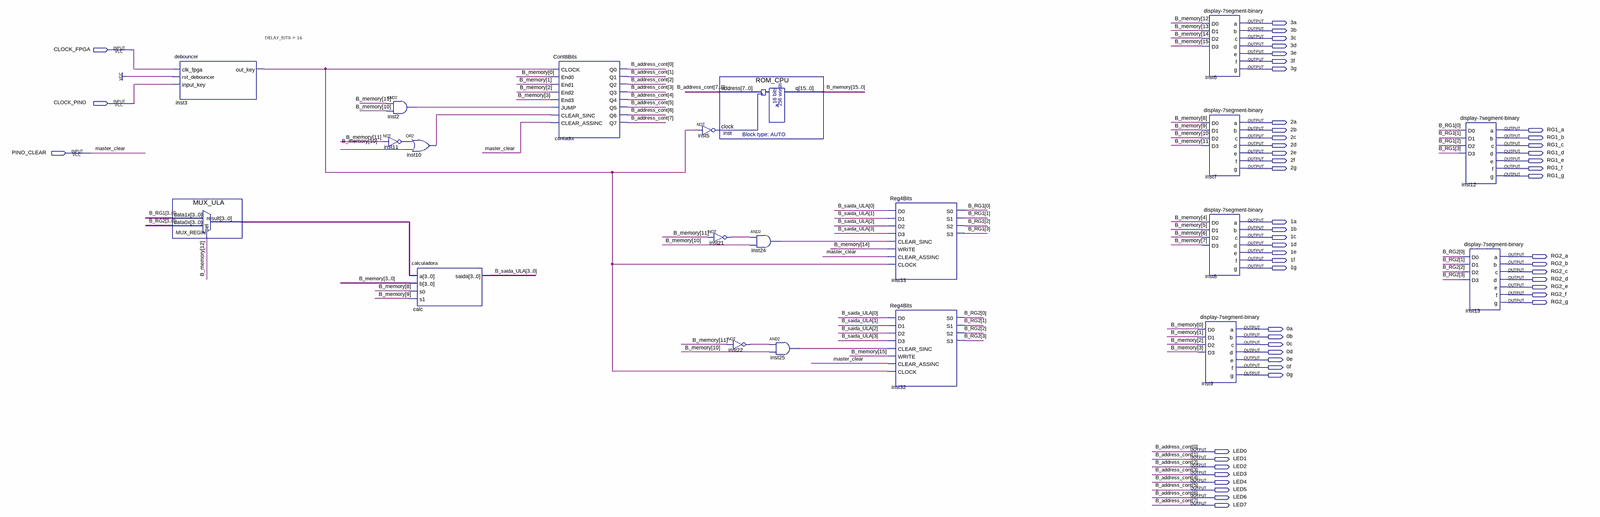
[diagram p0: schematic sheet, whole]
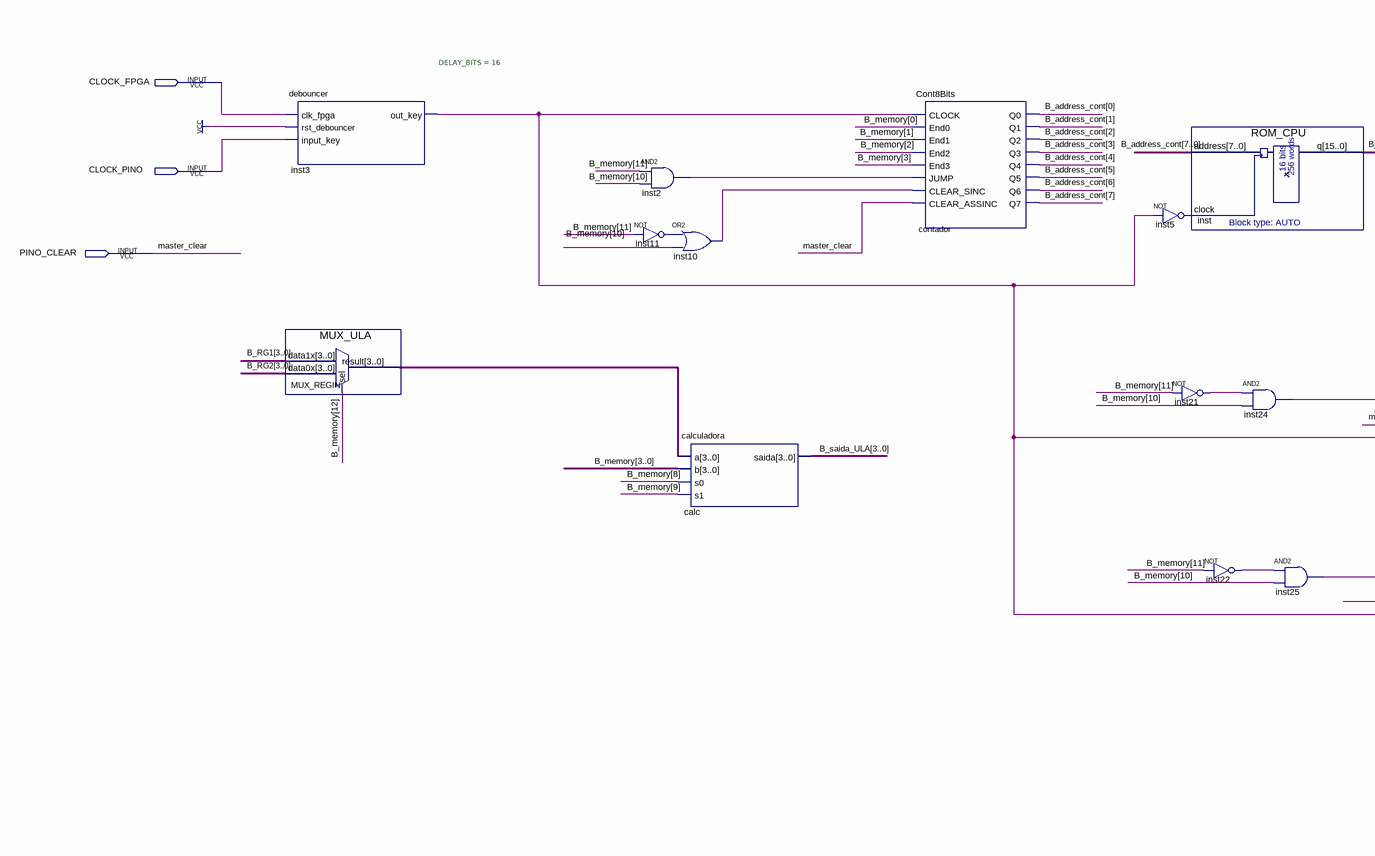
[diagram p1: schematic sheet, left part]
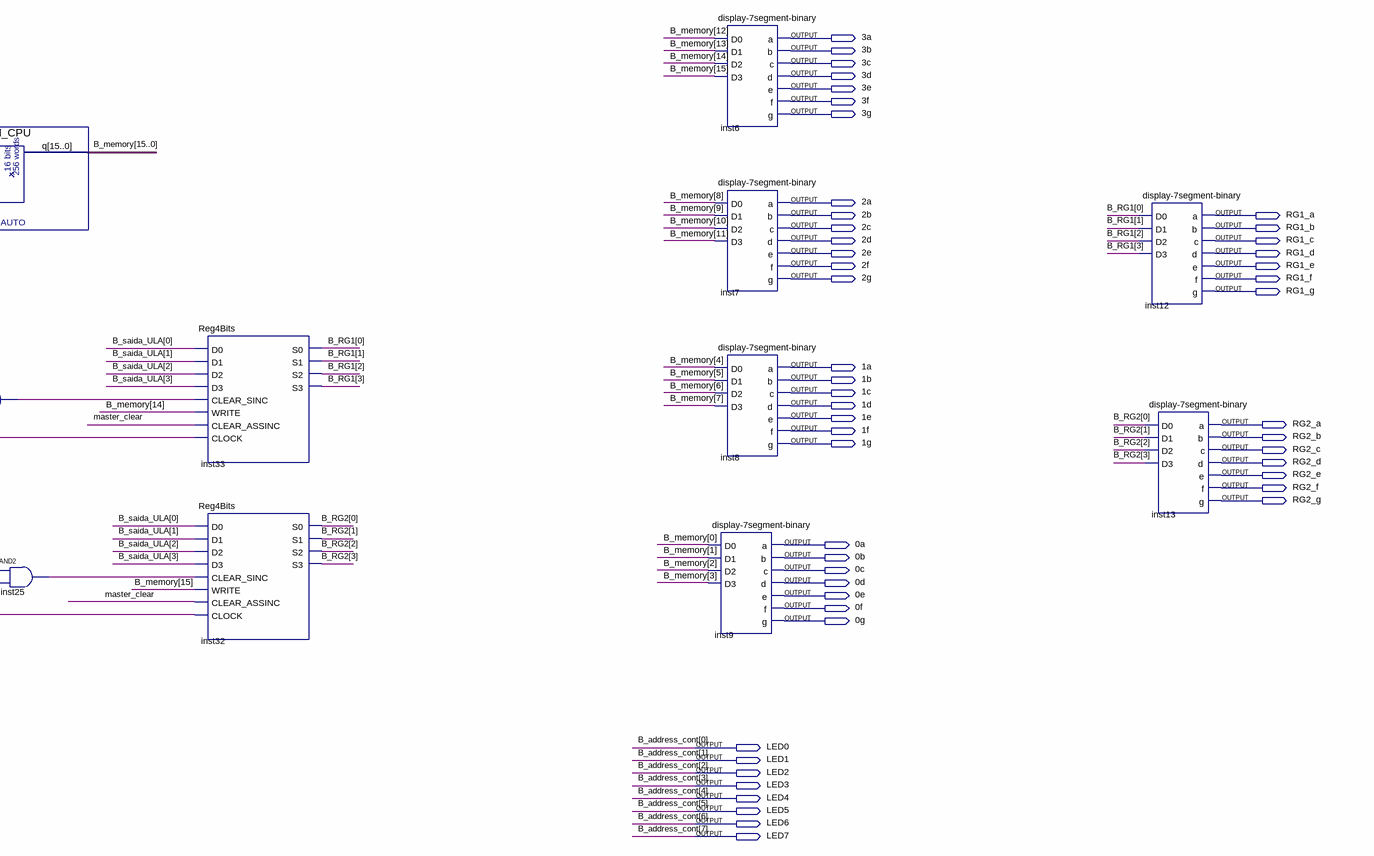
[diagram p2: schematic sheet, right part]
// Quartus schematic CPU_FPGA.bdf as structural Verilog: 21 symbols, 53 pins
module CPU_FPGA (
  input  CLOCK_FPGA,
  input  CLOCK_PINO,
  input  PINO_CLEAR,
  output \3a ,
  output \3b ,
  output \3c ,
  output \3d ,
  output \3e ,
  output \3f ,
  output \3g ,
  output \2a ,
  output \2b ,
  output RG1_a,
  output \2c ,
  output RG1_b,
  output \2d ,
  output RG1_c,
  output \2e ,
  output RG1_d,
  output \2f ,
  output RG1_e,
  output \2g ,
  output RG1_f,
  output RG1_g,
  output \1a ,
  output \1b ,
  output \1c ,
  output \1d ,
  output \1e ,
  output RG2_a,
  output \1f ,
  output RG2_b,
  output \1g ,
  output RG2_c,
  output RG2_d,
  output RG2_e,
  output RG2_f,
  output RG2_g,
  output \0a ,
  output \0b ,
  output \0c ,
  output \0d ,
  output \0e ,
  output \0f ,
  output \0g ,
  output LED0,
  output LED1,
  output LED2,
  output LED3,
  output LED4,
  output LED5,
  output LED6,
  output LED7
);

  wire inst2_out, inst3_out_key, inst5_out, inst10_out, inst11_out, inst21_out, inst22_out, inst24_out,
       inst25_out;
  wire [3:0] B_RG1, B_RG2, B_saida_ULA, MUX_REGIN_result;
  wire [15:0] B_memory;

  debouncer #(.DELAY_BITS(16)) inst3 (
    .clk_fpga(CLOCK_FPGA), .rst_debouncer(1'b1), .input_key(CLOCK_PINO), .out_key(inst3_out_key));
  MUX_ULA MUX_REGIN (.data1x(B_RG1), .data0x(B_RG2), .sel(B_memory[12]), .result(MUX_REGIN_result));
  and inst2 (inst2_out, B_memory[11], B_memory[10]);
  or inst10 (inst10_out, inst11_out, B_memory[10]);
  not inst11 (inst11_out, B_memory[11]);
  calculadora calc (.a(MUX_REGIN_result), .b(B_memory[3:0]), .s0(B_memory[8]), .s1(B_memory[9]), .saida(B_saida_ULA));
  Cont8Bits contador (
    .CLOCK(inst3_out_key), .End0(B_memory[0]), .End1(B_memory[1]), .End2(B_memory[2]), .End3(B_memory[3]),
    .JUMP(inst2_out), .CLEAR_SINC(inst10_out), .CLEAR_ASSINC(PINO_CLEAR), .Q0(LED0), .Q1(LED1), .Q2(LED2),
    .Q3(LED3), .Q4(LED4), .Q5(LED5), .Q6(LED6), .Q7(LED7));
  not inst5 (inst5_out, inst3_out_key);
  not inst21 (inst21_out, B_memory[11]);
  ROM_CPU inst (.address({LED7, LED6, LED5, LED4, LED3, LED2, LED1, LED0}), .clock(inst5_out), .q(B_memory));
  not inst22 (inst22_out, B_memory[11]);
  and inst24 (inst24_out, inst21_out, B_memory[10]);
  and inst25 (inst25_out, inst22_out, B_memory[10]);
  Reg4Bits inst33 (
    .D0(B_saida_ULA[0]), .D1(B_saida_ULA[1]), .D2(B_saida_ULA[2]), .D3(B_saida_ULA[3]),
    .CLEAR_SINC(inst24_out), .WRITE(B_memory[14]), .CLEAR_ASSINC(PINO_CLEAR), .CLOCK(inst3_out_key),
    .S0(B_RG1[0]), .S1(B_RG1[1]), .S2(B_RG1[2]), .S3(B_RG1[3]));
  Reg4Bits inst32 (
    .D0(B_saida_ULA[0]), .D1(B_saida_ULA[1]), .D2(B_saida_ULA[2]), .D3(B_saida_ULA[3]),
    .CLEAR_SINC(inst25_out), .WRITE(B_memory[15]), .CLEAR_ASSINC(PINO_CLEAR), .CLOCK(inst3_out_key),
    .S0(B_RG2[0]), .S1(B_RG2[1]), .S2(B_RG2[2]), .S3(B_RG2[3]));
  \display-7segment-binary  inst6 (
    .D0(B_memory[12]), .D1(B_memory[13]), .D2(B_memory[14]), .D3(B_memory[15]), .a(\3a ), .b(\3b ), .c(\3c ),
    .d(\3d ), .e(\3e ), .f(\3f ), .g(\3g ));
  \display-7segment-binary  inst7 (
    .D0(B_memory[8]), .D1(B_memory[9]), .D2(B_memory[10]), .D3(B_memory[11]), .a(\2a ), .b(\2b ), .c(\2c ),
    .d(\2d ), .e(\2e ), .f(\2f ), .g(\2g ));
  \display-7segment-binary  inst8 (
    .D0(B_memory[4]), .D1(B_memory[5]), .D2(B_memory[6]), .D3(B_memory[7]), .a(\1a ), .b(\1b ), .c(\1c ),
    .d(\1d ), .e(\1e ), .f(\1f ), .g(\1g ));
  \display-7segment-binary  inst9 (
    .D0(B_memory[0]), .D1(B_memory[1]), .D2(B_memory[2]), .D3(B_memory[3]), .a(\0a ), .b(\0b ), .c(\0c ),
    .d(\0d ), .e(\0e ), .f(\0f ), .g(\0g ));
  \display-7segment-binary  inst12 (
    .D0(B_RG1[0]), .D1(B_RG1[1]), .D2(B_RG1[2]), .D3(B_RG1[3]), .a(RG1_a), .b(RG1_b), .c(RG1_c), .d(RG1_d),
    .e(RG1_e), .f(RG1_f), .g(RG1_g));
  \display-7segment-binary  inst13 (
    .D0(B_RG2[0]), .D1(B_RG2[1]), .D2(B_RG2[2]), .D3(B_RG2[3]), .a(RG2_a), .b(RG2_b), .c(RG2_c), .d(RG2_d),
    .e(RG2_e), .f(RG2_f), .g(RG2_g));

  // Other names for the same wires on the sheet: B_address_cont[7:0] = {LED7, LED6, LED5, LED4, LED3, LED2, LED1, LED0};
  //   master_clear = PINO_CLEAR
endmodule
